# Altium schematic sheet Sheet10.SchDoc
size A4
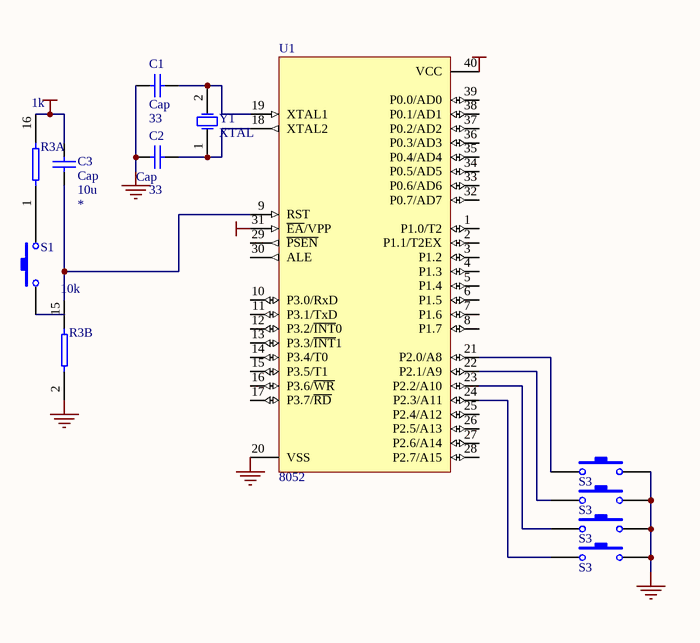
[diagram p0: Sheet10.SchDoc]

## Parts
(Parts that share a designator on the sheet are numbered #1, #2 ... from top to bottom, then left to right.)
C1  Cap  [RAD-0.3]
C2  Cap  [RAD-0.3]
C3  Cap  [RAD-0.3]
R3  Res Pack2  [DIP-16]  (value not drawn)  (parts A,B of 8)
S1  SW-PB  [SPST-2]  (value not drawn)
S3#1  SW-PB  [SPST-2]  (value not drawn)
S3#2  SW-PB  [SPST-2]  (value not drawn)
S3#3  SW-PB  [SPST-2]  (value not drawn)
S3#4  SW-PB  [SPST-2]  (value not drawn)
U1  8052  [SOT129-1]
Y1  XTAL  [BCY-W2/D3.1]

## Nets
+5: U1.31(~{EA}/VPP) U1.40(VCC)
+5v: C3.2 R3.16
GND: C1.2 C2.2 R3.2 S3#1.2 S3#2.2 S3#3.2 S3#4.2 U1.20(VSS)
NetC1_1: C1.1 U1.19(XTAL1) Y1.2(OSC2)
NetC2_1: C2.1 U1.18(XTAL2) Y1.1(OSC1)
NetC3_1: C3.1 R3.15 U1.9(RST)
NetR3_1: R3.1 S1.2
NetS3#1_1: S3#1.1 U1.21(P2.0/A8)
NetS3#2_1: S3#2.1 U1.22(P2.1/A9)
NetS3#3_1: S3#3.1 U1.23(P2.2/A10)
NetS3#4_1: S3#4.1 U1.24(P2.3/A11)

Not connected (* = marked no-connect by the designer): S1 1; U1 1(P1.0/T2) 2(P1.1/T2EX) 3(P1.2) 4(P1.3) 5(P1.4) 6(P1.5) 7(P1.6) 8(P1.7) 10(P3.0/RxD) 11(P3.1/TxD) 12(P3.2/~{INT}0) 13(P3.3/~{INT}1) 14(P3.4/T0) 15(P3.5/T1) 16(P3.6/~{WR}) 17(P3.7/~{RD}) 25(P2.4/A12) 26(P2.5/A13) 27(P2.6/A14) 28(P2.7/A15) 29(~{PSEN}) 30(ALE) 32(P0.7/AD7) 33(P0.6/AD6) 34(P0.5/AD5) 35(P0.4/AD4) 36(P0.3/AD3) 37(P0.2/AD2) 38(P0.1/AD1) 39(P0.0/AD0)

## Notes on the sheet
- (in symbol Cap) 33; 10u
- (in symbol Res Pack2, part A) 1k
- (in symbol Res Pack2, part B) 10k

## Library data of the parts
C1-C3 = Cap: Capacitor; Published: 8-Jun-2000; LatestRevisionDate: 17-Jul-2002; LatestRevisionNote: Re-released for DXP Platform.; Publisher: Altium Limited
R3 = Res Pack2: Isolated Resistor Network - Parts; Sim Note: Enter the Resistance value into parameter field.; Published: 24-Mar-1999; LatestRevisionDate: 17-Jul-2002; LatestRevisionNote: Re-released for DXP Platform.; Publisher: Altium Limited; Code_JEDEC: MO-001-AC
S1 S3#1-S3#4 = SW-PB: Switch; Published: 24-Mar-1999; LatestRevisionDate: 17-Jul-2002; LatestRevisionNote: Re-released for DXP Platform.; Publisher: Altium Limited
U1 = P80C31SBPN: 80C51 8-Bit Microcontroller Family: 128 B RAM, ROMless, 2.7 V-5.5 V, Low Power, High Speed; Published: 21-May-2003; DatasheetDocument: 7-Aug-2000; PackageDocument: 07-Aug-2000; PackageReference: SOT129-1; Publisher: Altium Limited; ComponentLink1Description: Manufacturer Link; ComponentLink1URL: http://www-us2.semiconductors.philips.com/; Code_JEDEC: MO-015
Y1 = XTAL: Crystal Oscillator; Published: 8-Jun-2000; LatestRevisionDate: 17-Jul-2002; LatestRevisionNote: Re-released for DXP Platform.; PackageReference: R38; Publisher: Altium Limited